# Altium schematic sheet Sensor_ExpandBoard_MPU6050.SchDoc: Sencor Card
size A4; Revision: V1.1; SheetNumber: 5; SheetTotal: 7; Function: MPU6050
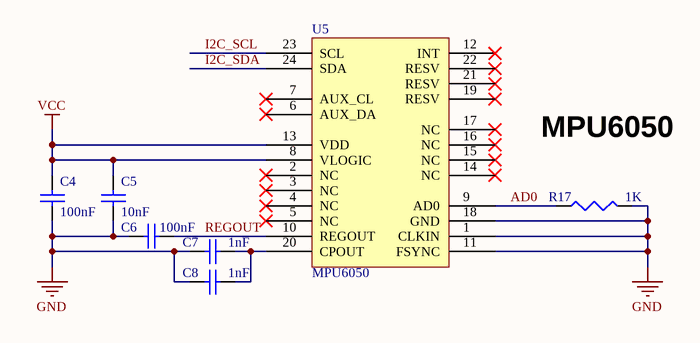
[diagram p0: Sensor_ExpandBoard_MPU6050.SchDoc]

## Parts
C4  100nF  [0603-2]
C5  10nF  [0603-2]
C6  100nF  [0603-2]
C7  1nF  [0603-2]
C8  1nF  [0603-2]
R17  1K  [R0603]
U5  MPU6050  [QFN24]

## Nets
GND: C4.2 C5.2 C6.2 C7.2 C8.1 R17.2 U5.1(CLKIN) U5.11(FSYNC) U5.18(GND)
VCC: C4.1 C5.1 U5.8(VLOGIC) U5.13(VDD)
AD0: R17.1 U5.9(AD0)
I2C_SCL: U5.23(SCL)
I2C_SDA: U5.24(SDA)
REGOUT: C6.1 U5.10(REGOUT)
NetC7_1: C7.1 C8.2 U5.20(CPOUT)

Not connected (* = marked no-connect by the designer): U5 2(NC)* 3(NC)* 4(NC)* 5(NC)* 6(AUX_DA)* 7(AUX_CL)* 12(INT)* 14(NC)* 15(NC)* 16(NC)* 17(NC)* 19(RESV)* 21(RESV)* 22(RESV)*

## Notes on the sheet
- MPU6050
- 工程名称：
- 图纸大小：
- 日期：
- A4
- 版本号：
- 页码：
- 第
- 共
- 制图：
- 审核：

## Library data of the parts
C4-C8 = Cap: 无极性电容; Published: 8-Jun-2000; LatestRevisionDate: 17-Jul-2002; LatestRevisionNote: Re-released for DXP Platform.; PackageReference: RAD-0.3; Publisher: Altium Limited
  C4 C6: Value: 100nF
  C5: Value: 10nF
  C7 C8: Value: 1nF
R17 = Res: Resistor; Published: 8-Jun-2000; LatestRevisionDate: 29-May-2009; LatestRevisionNote: IPC-7351 Footprint Added.; PackageReference: J1-0603; Publisher: Altium Limited; PackageDescription: Chip Resistor; Value: 1K
U5 = MPU6050: 6轴传感器，QFN24; LatestRevisionDate: 17-Jul-2002; LatestRevisionNote: Re-released for DXP Platform.; Publisher: Altium Limited; Value: MPU6050